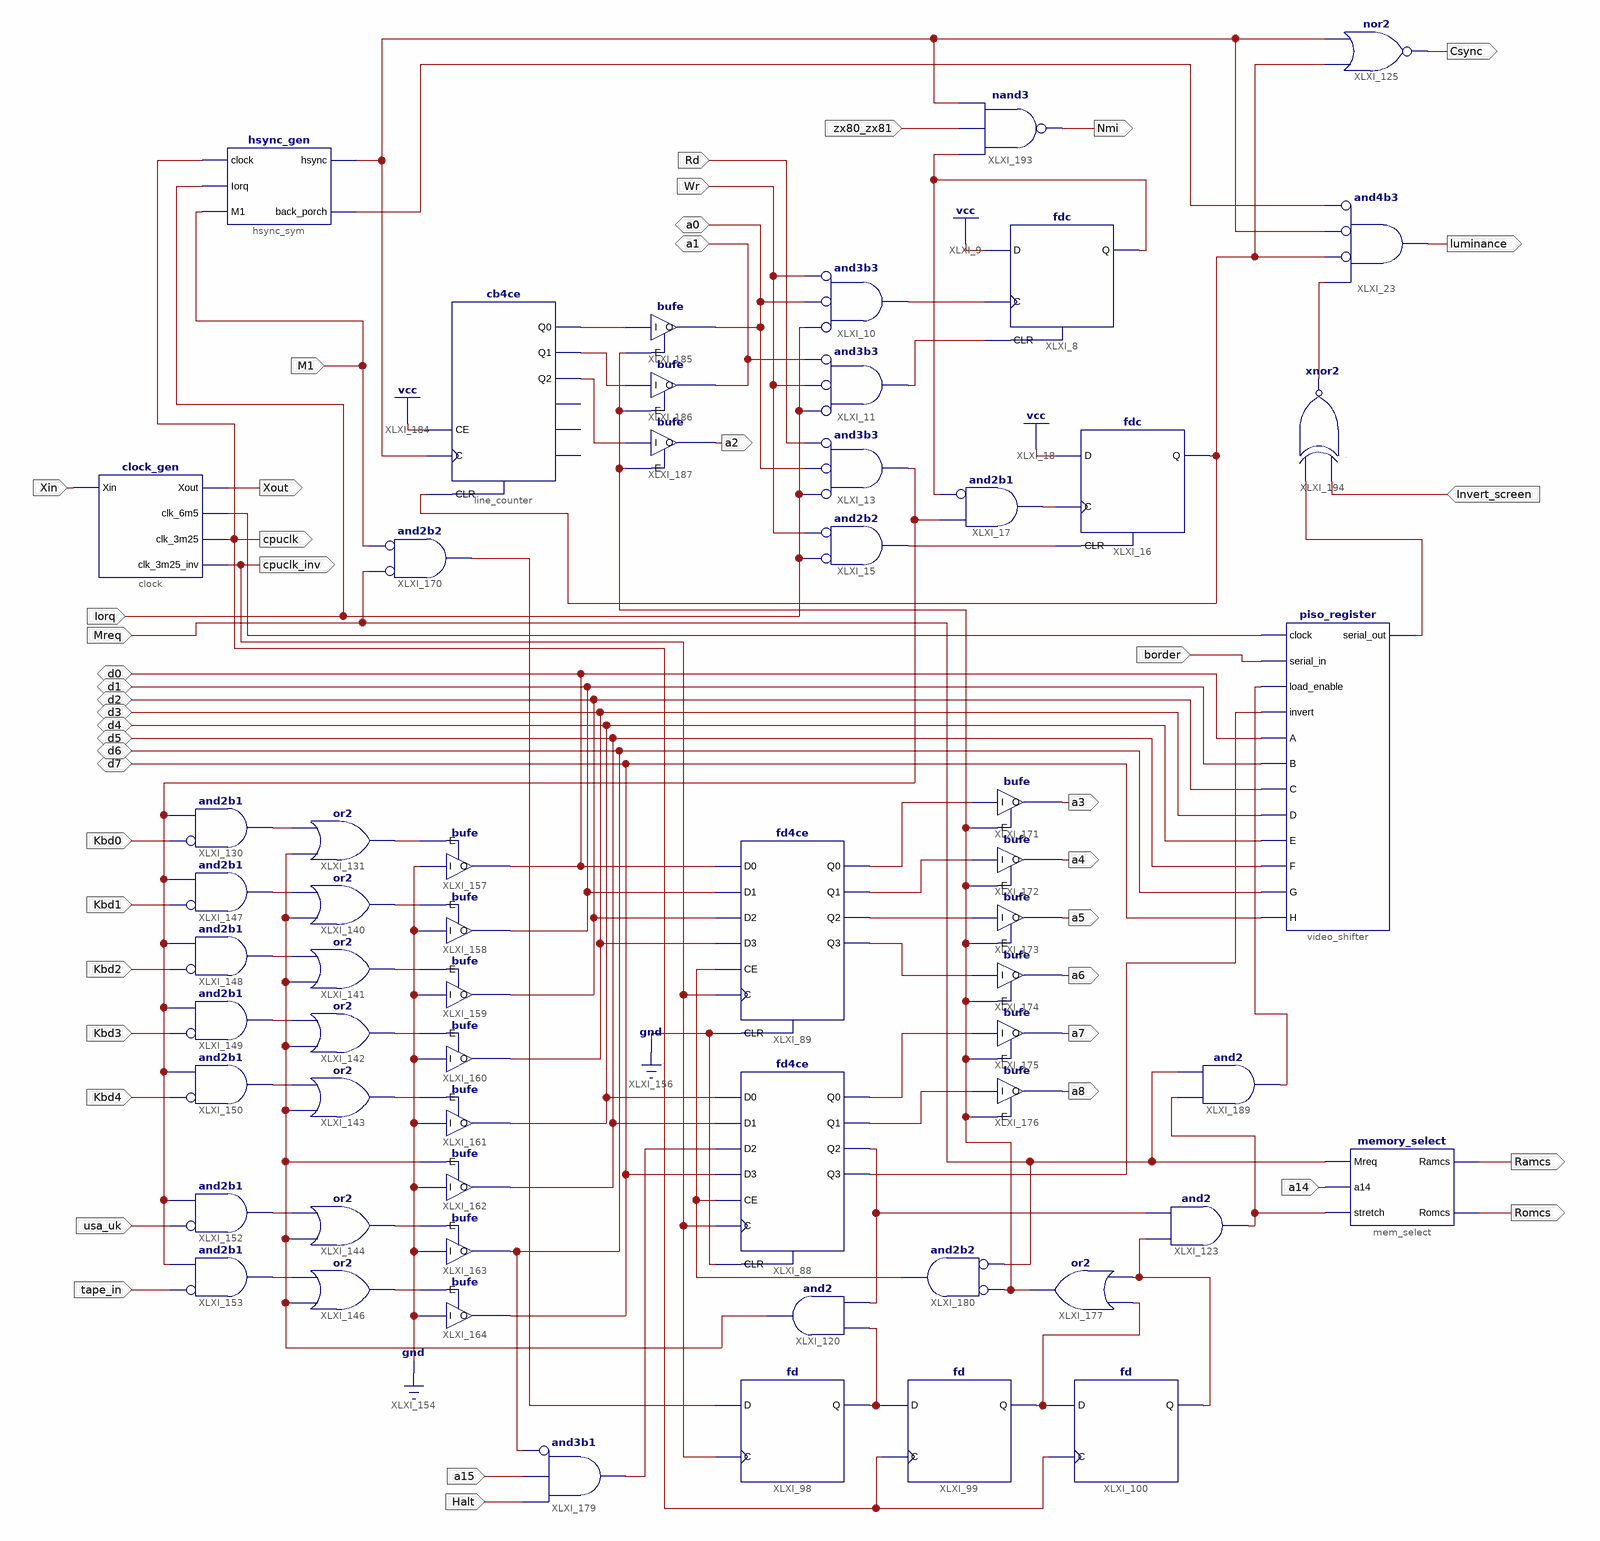
[diagram p0: schematic sheet 1]
// Xilinx ISE schematic zx81_ula.sch (xc9500) as structural Verilog: 59 symbols, 44 ports
module zx81_ula (
  input  Mreq,
  input  Iorq,
  input  M1,
  input  Wr,
  input  Rd,
  input  Xin,
  input  a14,
  input  Kbd0,
  input  Kbd1,
  input  Kbd2,
  input  Kbd3,
  input  Kbd4,
  input  usa_uk,
  input  tape_in,
  input  a15,
  input  Halt,
  input  border,
  input  Invert_screen,
  input  zx80_zx81,
  inout  a1,
  inout  a0,
  inout  d0,
  inout  d1,
  inout  d2,
  inout  d3,
  inout  d4,
  inout  d5,
  inout  d6,
  inout  d7,
  output Xout,
  output cpuclk,
  output Nmi,
  output Csync,
  output luminance,
  output a3,
  output a4,
  output a5,
  output a6,
  output a7,
  output a8,
  output Ramcs,
  output Romcs,
  output cpuclk_inv,
  output a2
);

  wire back_porch, black_on_white, char_latch_enable, clk_6m5, force_NOP, forced_NOP_cycle, forced_NOP_start,
       forced_NOP_T4, hsync, invert, ioread_fe, load_enable, m1_cycle, m1_cycle_T3, m1_cycle_T4, NMI_on,
       rfsh, start_NMI, start_vsync, stop_NMI, stop_vsync, video, vsync, XLXN_226, XLXN_307, XLXN_311,
       XLXN_312, XLXN_313, XLXN_314, XLXN_315, XLXN_316, XLXN_430, XLXN_431, XLXN_432, XLXN_433, XLXN_434,
       XLXN_435, XLXN_438, XLXN_448, XLXN_449, XLXN_450, XLXN_451, XLXN_452, XLXN_453, XLXN_517, XLXN_518,
       XLXN_520;

  fdc XLXI_8 (.C(start_NMI), .CLR(stop_NMI), .D(1'b1), .Q(NMI_on));
  and XLXI_10 (start_NMI, ~Iorq, ~a0, ~Wr);  // and3b3
  and XLXI_11 (stop_NMI, ~Iorq, ~Wr, ~a1);  // and3b3
  and XLXI_13 (ioread_fe, ~Iorq, ~a0, ~Rd);  // and3b3
  and XLXI_15 (stop_vsync, ~Iorq, ~Wr);  // and2b2
  fdc XLXI_16 (.C(start_vsync), .CLR(stop_vsync), .D(1'b1), .Q(vsync));
  and XLXI_17 (start_vsync, ~NMI_on, ioread_fe);  // and2b1
  and XLXI_23 (luminance, ~back_porch, ~hsync, ~vsync, video);  // and4b3
  cb4ce line_counter (
    .C(hsync), .CE(1'b1), .CLR(vsync), .Q0(XLXN_517), .Q1(XLXN_518), .Q2(XLXN_520));  // open: CEO, Q3, TC
  fd4ce XLXI_88 (
    .C(cpuclk_inv), .CE(char_latch_enable), .CLR(1'b0), .D0(d4), .D1(d5), .D2(forced_NOP_start), .D3(d7),
    .Q0(XLXN_434), .Q1(XLXN_435), .Q2(forced_NOP_cycle), .Q3(invert));
  fd4ce XLXI_89 (
    .C(cpuclk_inv), .CE(char_latch_enable), .CLR(1'b0), .D0(d0), .D1(d1), .D2(d2), .D3(d3), .Q0(XLXN_430),
    .Q1(XLXN_431), .Q2(XLXN_432), .Q3(XLXN_433));
  fd XLXI_98 (.C(cpuclk_inv), .D(m1_cycle), .Q(XLXN_226));
  fd XLXI_99 (.C(cpuclk), .D(XLXN_226), .Q(m1_cycle_T3));
  fd XLXI_100 (.C(cpuclk), .D(m1_cycle_T3), .Q(m1_cycle_T4));
  and XLXI_120 (force_NOP, forced_NOP_cycle, XLXN_226);
  and XLXI_123 (forced_NOP_T4, m1_cycle_T4, forced_NOP_cycle);
  nor XLXI_125 (Csync, vsync, hsync);
  and XLXI_130 (XLXN_438, ~Kbd0, ioread_fe);  // and2b1
  or XLXI_131 (XLXN_307, force_NOP, XLXN_438);
  or XLXI_140 (XLXN_311, force_NOP, XLXN_448);
  or XLXI_141 (XLXN_312, force_NOP, XLXN_449);
  or XLXI_142 (XLXN_313, force_NOP, XLXN_450);
  or XLXI_143 (XLXN_314, force_NOP, XLXN_451);
  or XLXI_144 (XLXN_315, force_NOP, XLXN_452);
  or XLXI_146 (XLXN_316, force_NOP, XLXN_453);
  and XLXI_147 (XLXN_448, ~Kbd1, ioread_fe);  // and2b1
  and XLXI_148 (XLXN_449, ~Kbd2, ioread_fe);  // and2b1
  and XLXI_149 (XLXN_450, ~Kbd3, ioread_fe);  // and2b1
  and XLXI_150 (XLXN_451, ~Kbd4, ioread_fe);  // and2b1
  and XLXI_152 (XLXN_452, ~usa_uk, ioread_fe);  // and2b1
  and XLXI_153 (XLXN_453, ~tape_in, ioread_fe);  // and2b1
  bufe XLXI_157 (.E(XLXN_307), .I(1'b0), .O(d0));
  bufe XLXI_158 (.E(XLXN_311), .I(1'b0), .O(d1));
  bufe XLXI_159 (.E(XLXN_312), .I(1'b0), .O(d2));
  bufe XLXI_160 (.E(XLXN_313), .I(1'b0), .O(d3));
  bufe XLXI_161 (.E(XLXN_314), .I(1'b0), .O(d4));
  bufe XLXI_162 (.E(force_NOP), .I(1'b0), .O(d5));
  bufe XLXI_163 (.E(XLXN_315), .I(1'b0), .O(d6));
  bufe XLXI_164 (.E(XLXN_316), .I(1'b0), .O(d7));
  and XLXI_170 (m1_cycle, ~Mreq, ~M1);  // and2b2
  bufe XLXI_171 (.E(rfsh), .I(XLXN_430), .O(a3));
  bufe XLXI_172 (.E(rfsh), .I(XLXN_431), .O(a4));
  bufe XLXI_173 (.E(rfsh), .I(XLXN_432), .O(a5));
  bufe XLXI_174 (.E(rfsh), .I(XLXN_433), .O(a6));
  bufe XLXI_175 (.E(rfsh), .I(XLXN_434), .O(a7));
  bufe XLXI_176 (.E(rfsh), .I(XLXN_435), .O(a8));
  or XLXI_177 (rfsh, m1_cycle_T4, m1_cycle_T3);
  and XLXI_179 (forced_NOP_start, ~d6, a15, Halt);  // and3b1
  and XLXI_180 (char_latch_enable, ~Mreq, ~rfsh);  // and2b2
  bufe XLXI_185 (.E(rfsh), .I(XLXN_517), .O(a0));
  bufe XLXI_186 (.E(rfsh), .I(XLXN_518), .O(a1));
  bufe XLXI_187 (.E(rfsh), .I(XLXN_520), .O(a2));
  and XLXI_189 (load_enable, forced_NOP_T4, Mreq);
  nand XLXI_193 (Nmi, NMI_on, zx80_zx81, hsync);
  xnor XLXI_194 (video, Invert_screen, black_on_white);
  clock_gen clock (.Xin(Xin), .Xout(Xout), .clk_6m5(clk_6m5), .clk_3m25(cpuclk), .clk_3m25_inv(cpuclk_inv));
  hsync_gen hsync_sym (.clock(cpuclk), .Iorq(Iorq), .M1(M1), .hsync(hsync), .back_porch(back_porch));
  memory_select mem_select (.Mreq(Mreq), .a14(a14), .stretch(forced_NOP_T4), .Ramcs(Ramcs), .Romcs(Romcs));
  piso_register video_shifter (
    .clock(clk_6m5), .serial_in(border), .load_enable(load_enable), .invert(invert), .A(d0), .B(d1), .C(d2),
    .D(d3), .E(d4), .F(d5), .G(d6), .H(d7), .serial_out(black_on_white));
endmodule
